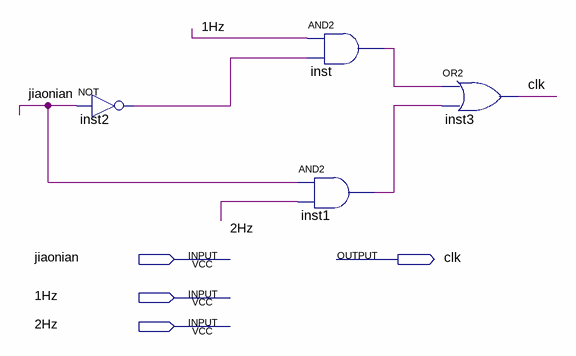
[diagram p0: schematic sheet]
// Quartus schematic jiaonian.bdf as structural Verilog: 4 symbols, 4 pins
module jiaonian (
  input  jiaonian,
  input  \1Hz ,
  input  \2Hz ,
  output clk
);

  wire inst1_out, inst2_out, inst_out;

  not inst2 (inst2_out, jiaonian);
  and inst (inst_out, \1Hz , inst2_out);
  and inst1 (inst1_out, jiaonian, \2Hz );
  or inst3 (clk, inst_out, inst1_out);
endmodule
